# Altium schematic sheet USB_Blaster.SchDoc
size A4; SheetNumber: 4; SheetTotal: 5
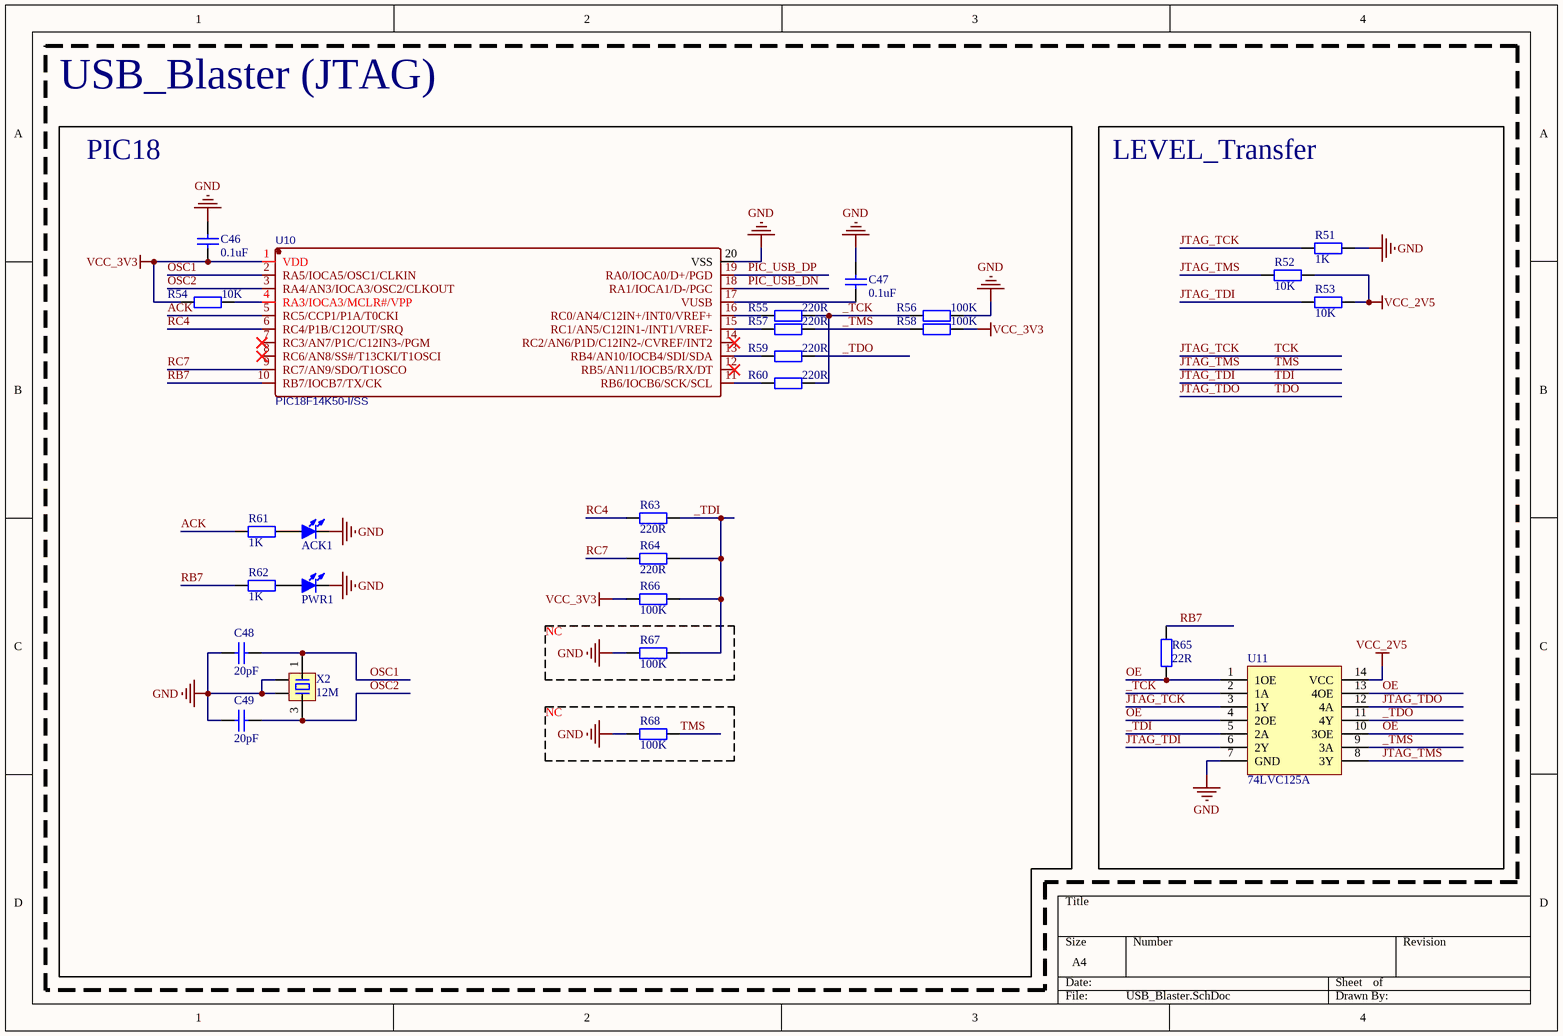
[diagram p0: USB_Blaster.SchDoc]

## Parts
ACK1  红色  [LED 0603G]  (value not drawn)
C46  0.1uF  [0402_C]
C47  0.1uF  [0402_C]
C48  20pF  [0402_C]
C49  20pF  [0402_C]
PWR1  红色  [LED 0603R]  (value not drawn)
R51  1K  [0402_R]
R52  10K  [0402_R]
R53  10K  [0402_R]
R54  10K  [0402_R]
R55  220R  [0402_R]
R56  100K  [0402_R]
R57  220R  [0402_R]
R58  100K  [0402_R]
R59  220R  [0402_R]
R60  220R  [0402_R]
R61  1K  [0402_R]
R62  1K  [0402_R]
R63  220R  [0402_R]
R64  220R  [0402_R]
R65  22R  [0402_R]
R66  100K  [0402_R]
R67  100K  [0402_R]
R68  100K  [0402_R]
U10  PIC18F14K50-I/SS  [SSOP20_L]
U11  74LVC125A  [TSSOP14_N]
X2  12M  [OSC 3225-4P]

## Blocks framed on the sheet
PIC18: ACK1 C46-C49 PWR1 R54-R64 R66 U10 X2
LEVEL_Transfer: R51-R53 R65 U11
NC: R67
NC: R68

## Nets
GND: ACK1.2(K) C46.2 C47.1 C48.1 C49.1 PWR1.2(K) R51.2 R56.2 R67.2 R68.2 U10.20(VSS) U11.7(GND) X2.2 X2.4
VCC_2V5: R52.2 R53.2 U11.14(VCC)
VCC_3V3: C46.1 R54.1 R58.2 R66.2 U10.1(VDD)
_TCK: R55.2 R56.1 R60.2 U11.2(1A)
_TDI: R63.2 R64.2 R66.1 R67.1 U11.5(2A)
_TDO: R59.2 U11.11(4Y)
_TMS: R57.2 R58.1 U11.9(3A)
ACK: R61.2 U10.5(RC5/CCP1/P1A/T0CKI)
JTAG_TCK: R51.1 U11.3(1Y)  [also labelled TCK]
JTAG_TDI: R53.1 U11.6(2Y)  [also labelled TDI]
JTAG_TDO: U11.12(4A)  [also labelled TDO]
JTAG_TMS: R52.1 R68.1 U11.8(3Y)  [also labelled TMS]
OE: R65.1 U11.1(1OE) U11.4(2OE) U11.10(3OE) U11.13(4OE)
OSC1: C48.2 U10.2(RA5/IOCA5/OSC1/CLKIN) X2.1
OSC2: C49.2 U10.3(RA4/AN3/IOCA3/OSC2/CLKOUT) X2.3
PIC_USB_DN: U10.18(RA1/IOCA1/D-/PGC)
PIC_USB_DP: U10.19(RA0/IOCA0/D+/PGD)
RB7: R62.2 R65.2 U10.10(RB7/IOCB7/TX/CK)
RC4: R63.1 U10.6(RC4/P1B/C12OUT/SRQ)
RC7: R64.1 U10.9(RC7/AN9/SDO/T1OSCO)
NetACK1_1: ACK1.1(A) R61.1
NetC47_2: C47.2 U10.17(VUSB)
NetPWR1_1: PWR1.1(A) R62.1
NetR54_2: R54.2 U10.4(RA3/IOCA3/MCLR#/VPP)
NetR55_1: R55.1 U10.16(RC0/AN4/C12IN+/INT0/VREF+)
NetR57_1: R57.1 U10.15(RC1/AN5/C12IN1-/INT1/VREF-)
NetR59_1: R59.1 U10.13(RB4/AN10/IOCB4/SDI/SDA)
NetR60_1: R60.1 U10.11(RB6/IOCB6/SCK/SCL)

Not connected (* = marked no-connect by the designer): U10 7(RC3/AN7/P1C/C12IN3-/PGM)* 8(RC6/AN8/SS#/T13CKI/T1OSCI)* 12(RB5/AN11/IOCB5/RX/DT)* 14(RC2/AN6/P1D/C12IN2-/CVREF/INT2)*

## Notes on the sheet
- USB_Blaster (JTAG)

## Library data of the parts
ACK1 = 0603_LED_G: 贴片LED; 版权归属: 源创客; BOM名称: 贴片LED; 学习资源: www.ooocke.com
C46-C49 = 0402_C: 贴片电容; ComponentLink1Description: 供应商链接; ComponentLink1URL: http://www.szlcsc.com/product/details_1928.html; Package: 0402; Supplier: LC; SuppliersPartNumber: C1576
PWR1 = 0603_LED_R: 贴片LED; 版权归属: 源创客; BOM名称: 贴片LED; 学习资源: www.ooocke.com
R51-R68 = 0402_R: 贴片电阻; ComponentLink1Description: 供应商链接; ComponentLink1URL: http://www.szlcsc.com/product/details_26667.html; Package: 0402; Supplier: LC; SuppliersPartNumber: C25924
U10 = PIC18F14K50-I/SS: BOM_Manufacturer: MICROCHIP; BOM_Supplier: LCSC; BOM_Manufacturer Part: PIC18F14K50-I/SS; BOM_Supplier Part: C12460; BOM_JLCPCB Part Class: Extended Part; spicePre: U; spiceSymbolName: PIC18F14K50-I/SS
X2 = XTAL-4P: 4脚无源晶振; 版权归属: 源创客; BOM名称: 4脚无源晶振; 学习资源: www.ooocke.com